# Altium project UCLA-DRS4-2.1.PrjPCB (part 2 of 7)

## Sheet ANA_FE.SchDoc: My title
size A3; Organization: University of California; Address1: 475 Portola Plaza; Address2: Los Angeles, CA 90095; Revision: R01; SheetNumber: 1; SheetTotal: 1
Used 8 times, as channels DRS-Module 0/FE0, DRS-Module 0/FE2, DRS-Module 0/FE4, DRS-Module 0/FE6, DRS-Module 0/FE1, DRS-Module 0/FE3, DRS-Module 0/FE5, DRS-Module 0/FE7. Parts and nets are listed once, with the designators drawn on the sheet.
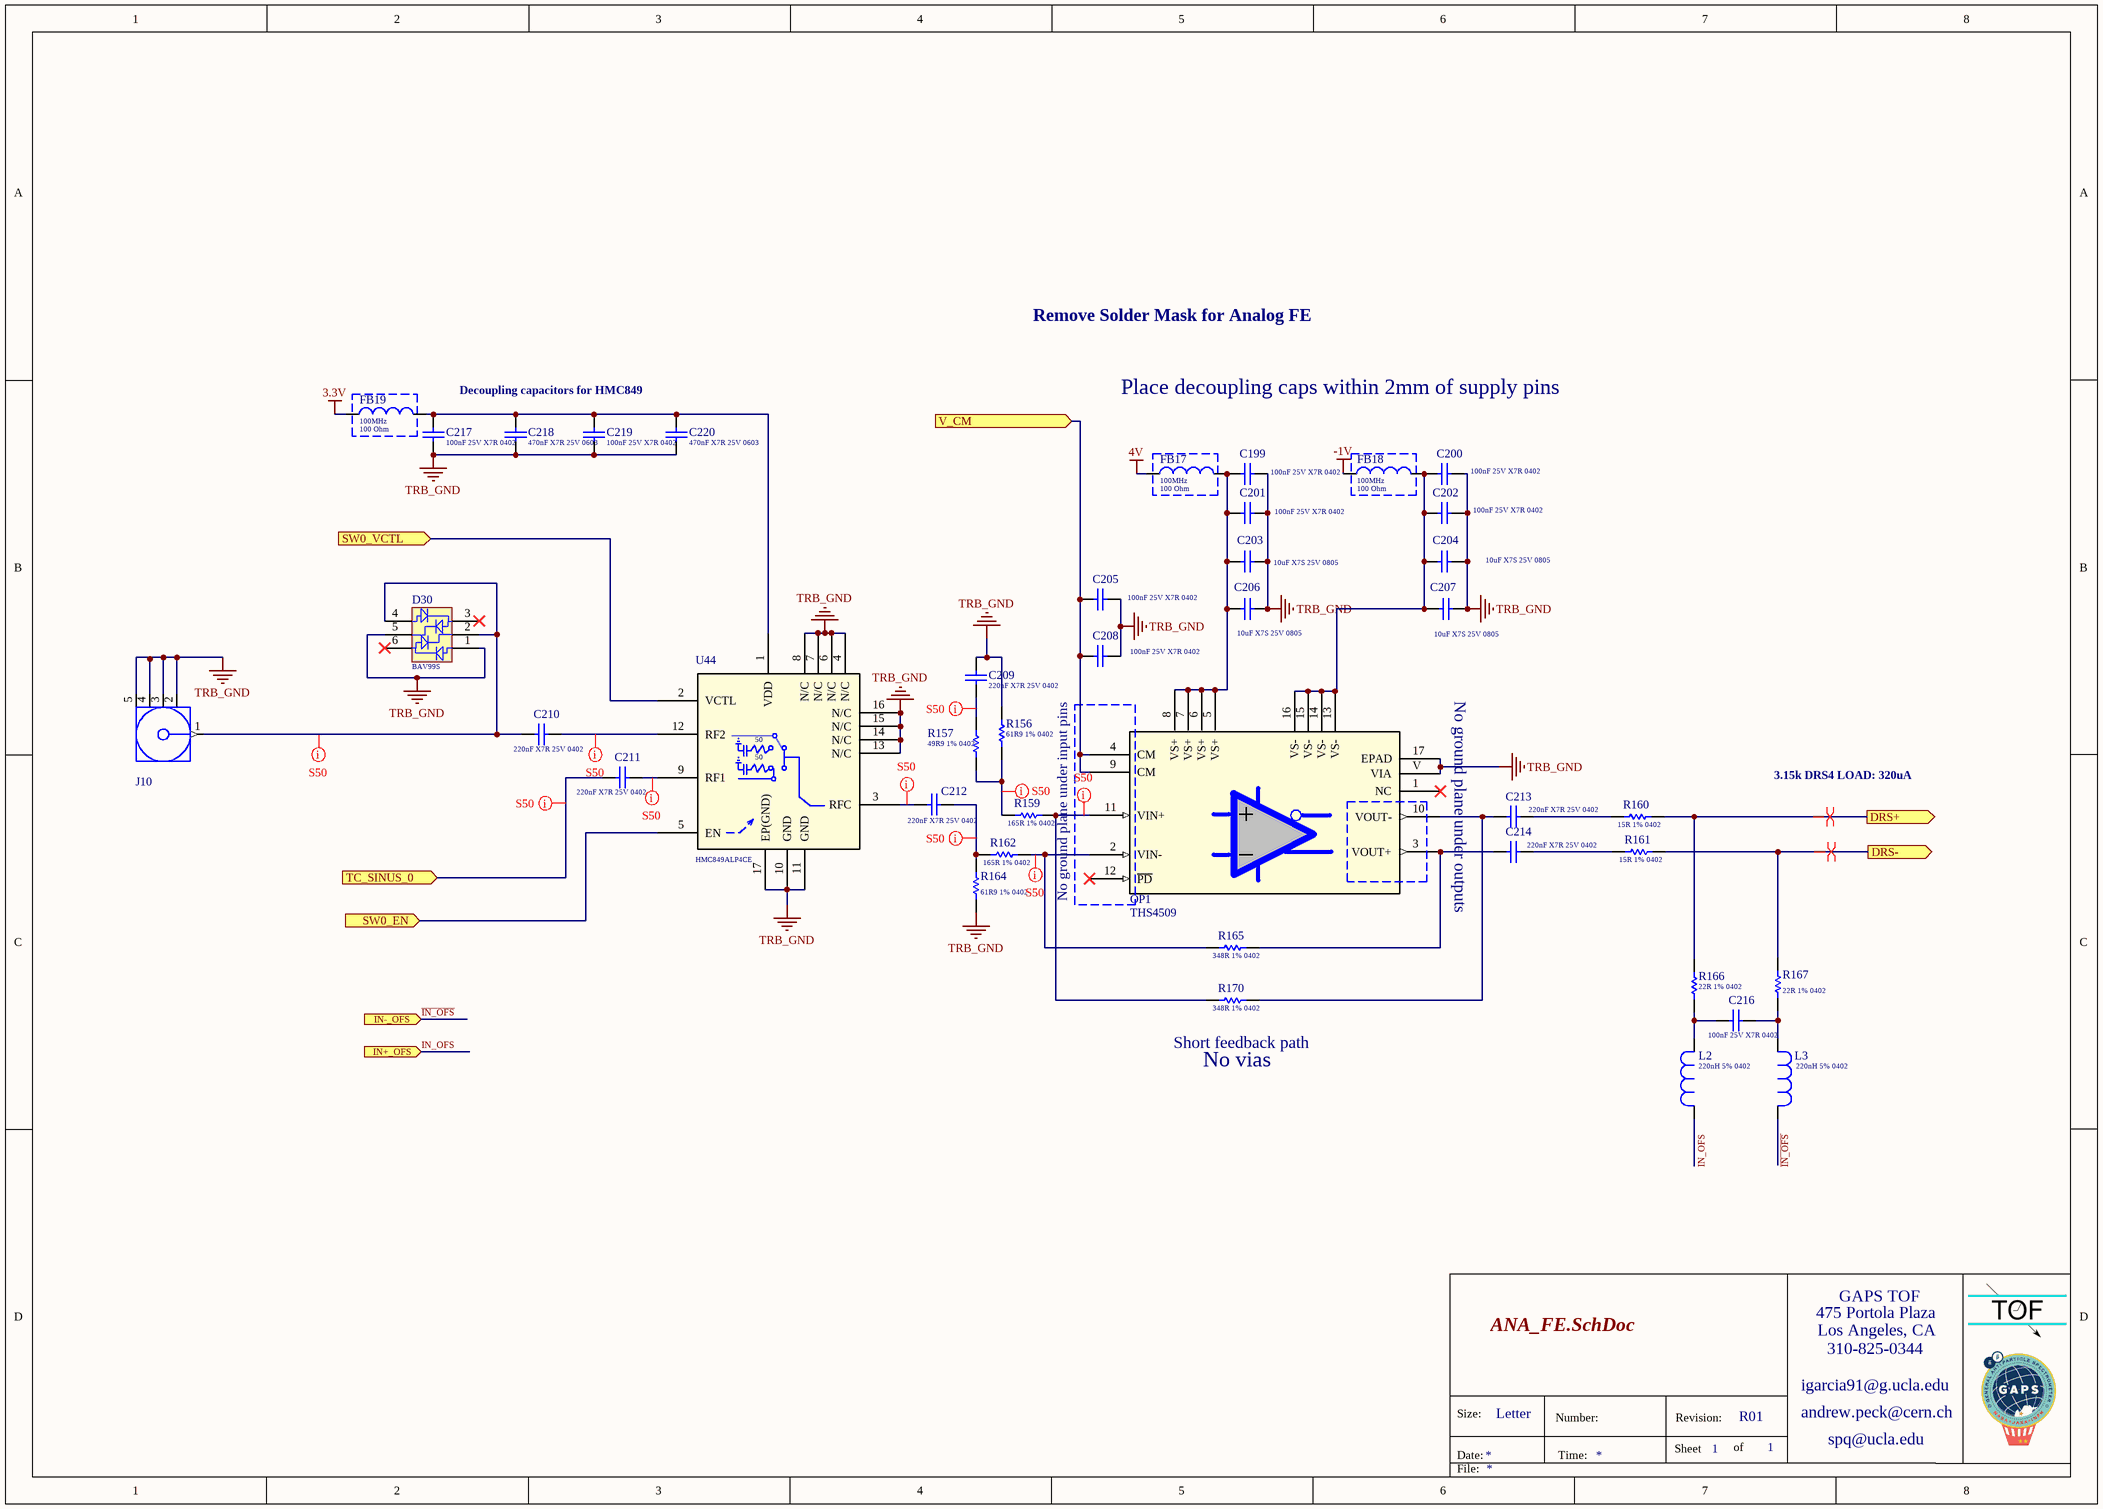
[diagram p3: ANA_FE.SchDoc]

### Parts
C199  Capacitance: 100nF 25V X7R 0402  [Cap_Taiyo_Yuden_TMK105B7104KV-FR_100nF]  (hidden comment: Cap_Taiyo_Yuden_TMK105B7104KV-FR_100nF)
C200  Capacitance: 100nF 25V X7R 0402  [Cap_Taiyo_Yuden_TMK105B7104KV-FR_100nF]  (hidden comment: Cap_Taiyo_Yuden_TMK105B7104KV-FR_100nF)
C201  Capacitance: 100nF 25V X7R 0402  [Cap_Taiyo_Yuden_TMK105B7104KV-FR_100nF]  (hidden comment: Cap_Taiyo_Yuden_TMK105B7104KV-FR_100nF)
C202  Capacitance: 100nF 25V X7R 0402  [Cap_Taiyo_Yuden_TMK105B7104KV-FR_100nF]  (hidden comment: Cap_Taiyo_Yuden_TMK105B7104KV-FR_100nF)
C203  Capacitance: 10uF X7S 25V 0805  [Cap_Murata_ GRM21BC71E106ME11L_10uF]  (hidden comment: Cap_Murata_ GRM21BC71E106ME11L_10uF)
C204  Capacitance: 10uF X7S 25V 0805  [Cap_Murata_ GRM21BC71E106ME11L_10uF]  (hidden comment: Cap_Murata_ GRM21BC71E106ME11L_10uF)
C205  Capacitance: 100nF 25V X7R 0402  [Cap_Taiyo_Yuden_TMK105B7104KV-FR_100nF]  (hidden comment: Cap_Taiyo_Yuden_TMK105B7104KV-FR_100nF)
C206  Capacitance: 10uF X7S 25V 0805  [Cap_Murata_ GRM21BC71E106ME11L_10uF]  (hidden comment: Cap_Murata_ GRM21BC71E106ME11L_10uF)
C207  Capacitance: 10uF X7S 25V 0805  [Cap_Murata_ GRM21BC71E106ME11L_10uF]  (hidden comment: Cap_Murata_ GRM21BC71E106ME11L_10uF)
C208  Capacitance: 100nF 25V X7R 0402  [Cap_Taiyo_Yuden_TMK105B7104KV-FR_100nF]  (hidden comment: Cap_Taiyo_Yuden_TMK105B7104KV-FR_100nF)
C209  Capacitance: 220nF X7R 25V 0402  [Cap_TDK_C1608X5R1A106M080AC_220nF]  (hidden comment: Cap_TDK_C1608X5R1A106M080AC_220nF)
C210  Capacitance: 220nF X7R 25V 0402  [Cap_TDK_C1608X5R1A106M080AC_220nF]  (hidden comment: Cap_TDK_C1608X5R1A106M080AC_220nF)
C211  Capacitance: 220nF X7R 25V 0402  [Cap_TDK_C1608X5R1A106M080AC_220nF]  (hidden comment: Cap_TDK_C1608X5R1A106M080AC_220nF)
C212  Capacitance: 220nF X7R 25V 0402  [Cap_TDK_C1608X5R1A106M080AC_220nF]  (hidden comment: Cap_TDK_C1608X5R1A106M080AC_220nF)
C213  Capacitance: 220nF X7R 25V 0402  [Cap_TDK_C1608X5R1A106M080AC_220nF]  (hidden comment: Cap_TDK_C1608X5R1A106M080AC_220nF)
C214  Capacitance: 220nF X7R 25V 0402  [Cap_TDK_C1608X5R1A106M080AC_220nF]  (hidden comment: Cap_TDK_C1608X5R1A106M080AC_220nF)
C216  Capacitance: 100nF 25V X7R 0402  [Cap_Taiyo_Yuden_TMK105B7104KV-FR_100nF]  (hidden comment: Cap_Taiyo_Yuden_TMK105B7104KV-FR_100nF)
C217  Capacitance: 100nF 25V X7R 0402  [Cap_Taiyo_Yuden_TMK105B7104KV-FR_100nF]  (hidden comment: Cap_Taiyo_Yuden_TMK105B7104KV-FR_100nF)
C218  Capacitance: 470nF X7R 25V 0603  [Cap_Wurth_Electronics_885012206075_470nF]  (hidden comment: Cap_Wurth_Electronics_885012206075_470nF)
C219  Capacitance: 100nF 25V X7R 0402  [Cap_Taiyo_Yuden_TMK105B7104KV-FR_100nF]  (hidden comment: Cap_Taiyo_Yuden_TMK105B7104KV-FR_100nF)
C220  Capacitance: 470nF X7R 25V 0603  [Cap_Wurth_Electronics_885012206075_470nF]  (hidden comment: Cap_Wurth_Electronics_885012206075_470nF)
D30  BAV99S  [INF-SOT363_V]
FB17  Measuring Frequency: 100MHz  Impedance: 100 Ohm  [FB_Wurth_Electronics_742792731_100Ohms]  (hidden comment: 742792731)
FB18  Measuring Frequency: 100MHz  Impedance: 100 Ohm  [FB_Wurth_Electronics_742792731_100Ohms]  (hidden comment: 742792731)
FB19  Measuring Frequency: 100MHz  Impedance: 100 Ohm  [FB_Wurth_Electronics_742792731_100Ohms]  (hidden comment: 742792731)
J10  CONREVSMA003.062  [CON-SMA-EDGE062]  (value not drawn)
L2  Inductance: 220nH 5% 0402  [Ind_TDK_ MLG1005SR22JT000_220nH]  (hidden comment: Ind_TDK_ MLG1005SR22JT000_220nH)
L3  Inductance: 220nH 5% 0402  [Ind_TDK_ MLG1005SR22JT000_220nH]  (hidden comment: Ind_TDK_ MLG1005SR22JT000_220nH)
OP1  THS4509  [RGT16]
R156  61R9 1% 0402  [RESC0402(1005)_L]
R157  49R9 1% 0402  [RESC0402(1005)_L]
R159  165R 1% 0402  [RESC0402(1005)_L]
R160  15R 1% 0402  [RESC0402(1005)_L]
R161  15R 1% 0402  [RESC0402(1005)_L]
R162  165R 1% 0402  [RESC0402(1005)_L]
R164  61R9 1% 0402  [RESC0402(1005)_L]
R165  348R 1% 0402  [RESC0402(1005)_L]
R166  22R 1% 0402  [RESC0402(1005)_L]
R167  22R 1% 0402  [RESC0402(1005)_L]
R170  348R 1% 0402  [RESC0402(1005)_L]
U44  HMC849  [CP_16_40]  (value not drawn)

### Ports
DRS+ (out), DRS- (out), IN+_OFS (in), IN-_OFS (in), SW0_EN (in), SW0_VCTL (in), TC_SINUS_0 (in), V_CM (in)

### Nets
3.3V: FB19.1
4V: FB17.1
-1V: FB18.1
TRB_GND: C199.2 C200.2 C201.2 C202.2 C203.1 C204.1 C205.2 C206.1 C207.1 C208.2 C209.1 C217.1 C218.2 C219.1 C220.2 D30.1(A1) D30.5(K5) J10.2(GND) J10.3(GND) J10.4(GND) J10.5(GND) OP1.17(EPAD) OP1.V(VIA) R156.2 R164.1 U44.4(N/C) U44.6(N/C) U44.7(N/C) U44.8(N/C) U44.10(GND) U44.11(GND) U44.13(N/C) U44.14(N/C) U44.15(N/C) U44.16(N/C) U44.17(EP(GND))
DRS+: R160.2 R166.2 ; port DRS+
DRS-: R161.2 R167.2 ; port DRS-
~{IN}~{_OFS}: L3.1 ; port IN-_OFS
IN_OFS: L2.2 ; port IN+_OFS
SW0_EN: U44.5(EN) ; port SW0_EN
SW0_VCTL: U44.2(VCTL) ; port SW0_VCTL
TC_SINUS_0: C211.2 ; port TC_SINUS_0
V_CM: C205.1 C208.1 OP1.4(CM) OP1.9(CM) ; port V_CM
NetC199_1: C199.1 C201.1 C203.2 C206.2 FB17.2 OP1.5(VS+) OP1.6(VS+) OP1.7(VS+) OP1.8(VS+)
NetC200_1: C200.1 C202.1 C204.2 C207.2 FB18.2 OP1.13(VS-) OP1.14(VS-) OP1.15(VS-) OP1.16(VS-)
NetC209_2: C209.2 R157.2
NetC210_1: C210.1 U44.12(RF2)
NetC210_2: C210.2 D30.2(K2) D30.4(A4) J10.1(Signal)
NetC211_1: C211.1 U44.9(RF1)
NetC212_1: C212.1 R162.1 R164.2
NetC212_2: C212.2 U44.3(RFC)
NetC213_1: C213.1 R160.1
NetC213_2: C213.2 OP1.10(VOUT-) R170.2
NetC214_1: C214.1 R161.1
NetC214_2: C214.2 OP1.3(VOUT+) R165.2
NetC216_1: C216.1 L2.1 R166.1
NetC216_2: C216.2 L3.2 R167.1
NetC217_2: C217.2 C218.1 C219.2 C220.1 FB19.2 U44.1(VDD)
NetOP1_2: OP1.2(VIN-) R162.2 R165.1
NetOP1_11: OP1.11(VIN+) R159.2 R170.1
NetR156_1: R156.1 R157.1 R159.1

Not connected (* = marked no-connect by the designer): D30 3(C3)* 6(C6)*; OP1 1(NC)* 12(~{PD})*

### Channels
DRS-Module 0/FE0: designators end in A; ports DRS+=DRS4_IN0_P DRS-=DRS4_IN0_N IN+_OFS=IN+_OFS IN-_OFS=~{IN}~{_OFS} SW0_EN=HMC849:EN0 SW0_VCTL=HMC849:VCTL0 TC_SINUS_0=TC_0 V_CM=V_CM
DRS-Module 0/FE2: designators end in B; ports DRS+=DRS4_IN2_P DRS-=DRS4_IN2_N IN+_OFS=IN+_OFS IN-_OFS=~{IN}~{_OFS} SW0_EN=HMC849:EN2 SW0_VCTL=HMC849:VCTL2 TC_SINUS_0=TC_2 V_CM=V_CM
DRS-Module 0/FE4: designators end in C; ports DRS+=DRS4_IN4_P DRS-=DRS4_IN4_N IN+_OFS=IN+_OFS IN-_OFS=~{IN}~{_OFS} SW0_EN=HMC849:EN4 SW0_VCTL=HMC849:VCTL4 TC_SINUS_0=TC_4 V_CM=V_CM
DRS-Module 0/FE6: designators end in D; ports DRS+=DRS4_IN6_P DRS-=DRS4_IN6_N IN+_OFS=IN+_OFS IN-_OFS=~{IN}~{_OFS} SW0_EN=HMC849:EN6 SW0_VCTL=HMC849:VCTL6 TC_SINUS_0=TC_6 V_CM=V_CM
DRS-Module 0/FE1: designators end in E; ports DRS+=DRS4_IN1_P DRS-=DRS4_IN1_N IN+_OFS=IN+_OFS IN-_OFS=~{IN}~{_OFS} SW0_EN=HMC849:EN1 SW0_VCTL=HMC849:VCTL1 TC_SINUS_0=TC_1 V_CM=V_CM
DRS-Module 0/FE3: designators end in F; ports DRS+=DRS4_IN3_P DRS-=DRS4_IN3_N IN+_OFS=IN+_OFS IN-_OFS=~{IN}~{_OFS} SW0_EN=HMC849:EN3 SW0_VCTL=HMC849:VCTL3 TC_SINUS_0=TC_3 V_CM=V_CM
DRS-Module 0/FE5: designators end in G; ports DRS+=DRS4_IN5_P DRS-=DRS4_IN5_N IN+_OFS=IN+_OFS IN-_OFS=~{IN}~{_OFS} SW0_EN=HMC849:EN5 SW0_VCTL=HMC849:VCTL5 TC_SINUS_0=TC_5 V_CM=V_CM
DRS-Module 0/FE7: designators end in H; ports DRS+=DRS4_IN7_P DRS-=DRS4_IN7_N IN+_OFS=IN+_OFS IN-_OFS=~{IN}~{_OFS} SW0_EN=HMC849:EN7 SW0_VCTL=HMC849:VCTL7 TC_SINUS_0=TC_7 V_CM=V_CM

### Layout directives
net class S50: NetC209A_2, NetC210A_1, NetC210A_2, NetC211A_1, NetC212A_1, NetC212A_2, NetOP1A_2, NetOP1A_11, NetR156A_1, TC_0
differential pair: DRS4_IN0_N, DRS4_IN0_P

### Notes on the sheet
- Remove Solder Mask for Analog FE
- Decoupling capacitors for HMC849
- Place decoupling caps within 2mm of supply pins
- No ground plane under outputs
- 3.15k DRS4 LOAD: 320uA
- (near R159) No ground plane under input pins
- (near R170) Short feedback path
- (near R170) No vias
- 475 Portola Plaza
- GAPS TOF
- igarcia91@g.ucla.edu
- Los Angeles, CA
- 310-825-0344
- Size:
- Date:
- Letter
- Number:
- Time:
- Sheet
- Revision:
- of
- andrew.peck@cern.ch
- spq@ucla.edu
- File:
- (in symbol HMC849ALP4CE) 50

### Library data of the parts
C199-C202 C205 C208 C216 C217 C219 = Cap_Taiyo_Yuden_TMK105B7104KV-FR_100nF: CAP CER 100nF 25V X7R 0402; Supplier 1: Mouser; Supplier Part Number 1: 963-TMK105B7104KV-FR
C203 C204 C206 C207 = Cap_Murata_ GRM21BC71E106ME11L_10uF: CAP CER 10uF 25V X7R 0805; Supplier 1: Mouser; Supplier Part Number 1: 81-GRM21BC71E106ME1L
C209-C214 = Cap_TDK_C1608X5R1A106M080AC_220nF: CAP CER 220nF 50V X7R 0402; Supplier 1: Mouser; Supplier Part Number 1: 810-C1005X7R1E224KBE
C218 C220 = Cap_Wurth_Electronics_885012206075_470nF: CAP CER 470nF 25V X7R 0603; Supplier 1: Mouser; Supplier Part Number 1: 710-885012206075
D30 = CMP-1176-00030-1: Silicon Switching Diode, SOT363, Reel, Green; Manufacturer: Infineon; VR (max): 80Â V; VBR (min): 85Â V; IF (max): 200Â mA; trr (max): 4Â ns; Green: TRUE; VF (max): 1.25Â V; Configuration: Quadruple; IR (max): 150Â nA; PackageReference: SOT363; Halogen-free: TRUE; ComponentLink3URL: http://www.infineon.com/dgdl/SOT363-Package_Overview.pdf?folderId=db3a30431936bc4b01195360bd8f3cdc&fileId=db3a30431936bc4b0119536b62bf3cf5; PartNumber: BAV99S; ComponentLink3Description: Package Specification; ComponentLink2URL: http://www.infineon.com/dgdl/bav99series.pdf?folderId=db3a30431400ef6801141b5844e103ea&fileId=db3a30431400ef6801141c1b237d042f; ComponentLink1Description: Manufacturer URL; ComponentLink2Description: Datasheet; ComponentLink1URL: http://www.infineon.com/; PackageDescription: 6-Pin Small Outline Transistor Package, 1.25 x 2 mm Body; Mounting Technology: Surface Mount
FB17-FB19 = FB_Wurth_Electronics_742792731_100Ohms: FB SMD 100 OHM 25% 1.2A 0402; DC Resistance: 90mOhm; Supplier 1: Mouser; Supplier Part Number 1: 710-742792731
J10 = CMP-0168-00046-1: PCB_Layout: Pads complies with manufacturer's recommendation.; DatasheetVersion: rev1.0, Jun-2006; PackageVersion: rev1.0, Jun-2006; PackageReference: CON-SMA-EDGE062
L2 L3 = Ind_TDK_ MLG1005SR22JT000_220nH: Fixed Inductors .22 UH 5%; Supplier 1: Mouser; Supplier Part Number 1: 810-MLG1005SR22JT000
OP1 = THS4509RGTT: Imported; Vendor: Texas Instruments; Built_By: EMA_UL_Team; C: Copyright (C) 2015 Accelerated Designs. All rights reserved; Manufacturer_Part_Number: THS4509RGTT; RefDes: RefDes; Type: DEV; Value: Value; Supplier 1: Mouser; Supplier Part Number 1: 595-THS4509RGTT
R156 R164 = CMP-1011-00374-1: 61R9 0.063W 1% 0402 (1005 Metric)  SMD; Value: 61.90 Ohm; Case-EIA: 0402; Case-Metric: 1005; Tolerance: 1 %; Technology: SMT; Power: 0.063 W
R157 = CMP-1011-00363-1: 49R9 0.063W 1% 0402 (1005 Metric)  SMD; Case-EIA: 0402; Case-Metric: 1005; Value: 49.90 Ohm; Power: 0.063 W; Technology: SMT; Tolerance: 1 %
R159 R162 = CMP-1011-00420-1: 165R 0.063W 1% 0402 (1005 Metric)  SMD; Case-EIA: 0402; Case-Metric: 1005; Value: 165.00 Ohm; Power: 0.063 W; Technology: SMT; Tolerance: 1 %
R160 R161 = CMP-1011-00302-1: 15R 0.063W 1% 0402 (1005 Metric)  SMD; Case-Metric: 1005; Case-EIA: 0402; Value: 15.00 Ohm; Tolerance: 1 %; Power: 0.063 W; Technology: SMT
R165 R170 = CMP-1011-00457-1: 348R 0.063W 1% 0402 (1005 Metric)  SMD; Case-EIA: 0402; Value: 348.00 Ohm; Case-Metric: 1005; Tolerance: 1 %; Technology: SMT; Power: 0.063 W
R166 R167 = CMP-1011-00320-1: 22R 0.063W 1% 0402 (1005 Metric)  SMD; Case-EIA: 0402; Case-Metric: 1005; Value: 22.00 Ohm; Tolerance: 1 %; Technology: SMT; Power: 0.063 W
U44 = HMC849ALP4CE: RF Switch ICs DC-6 GHZ Hi Isolation Switch; Vendor: Analog Devices Inc; Built_By: Analog Devices Imc.; Manufacturer_Part_Number: HMC849ALP4CE; RefDes: RefDes; Type: DEV; Supplier 1: Mouser; Supplier Part Number 1: 584-HMC849ALP4CE; Series: HMC849ALP4CE

## Sheet DRS4_ADC.SchDoc: My title
size A3; Organization: University of California; Address1: 475 Portola Plaza; Address2: Los Angeles, CA 90095; Revision: R01; SheetNumber: 1; SheetTotal: 1
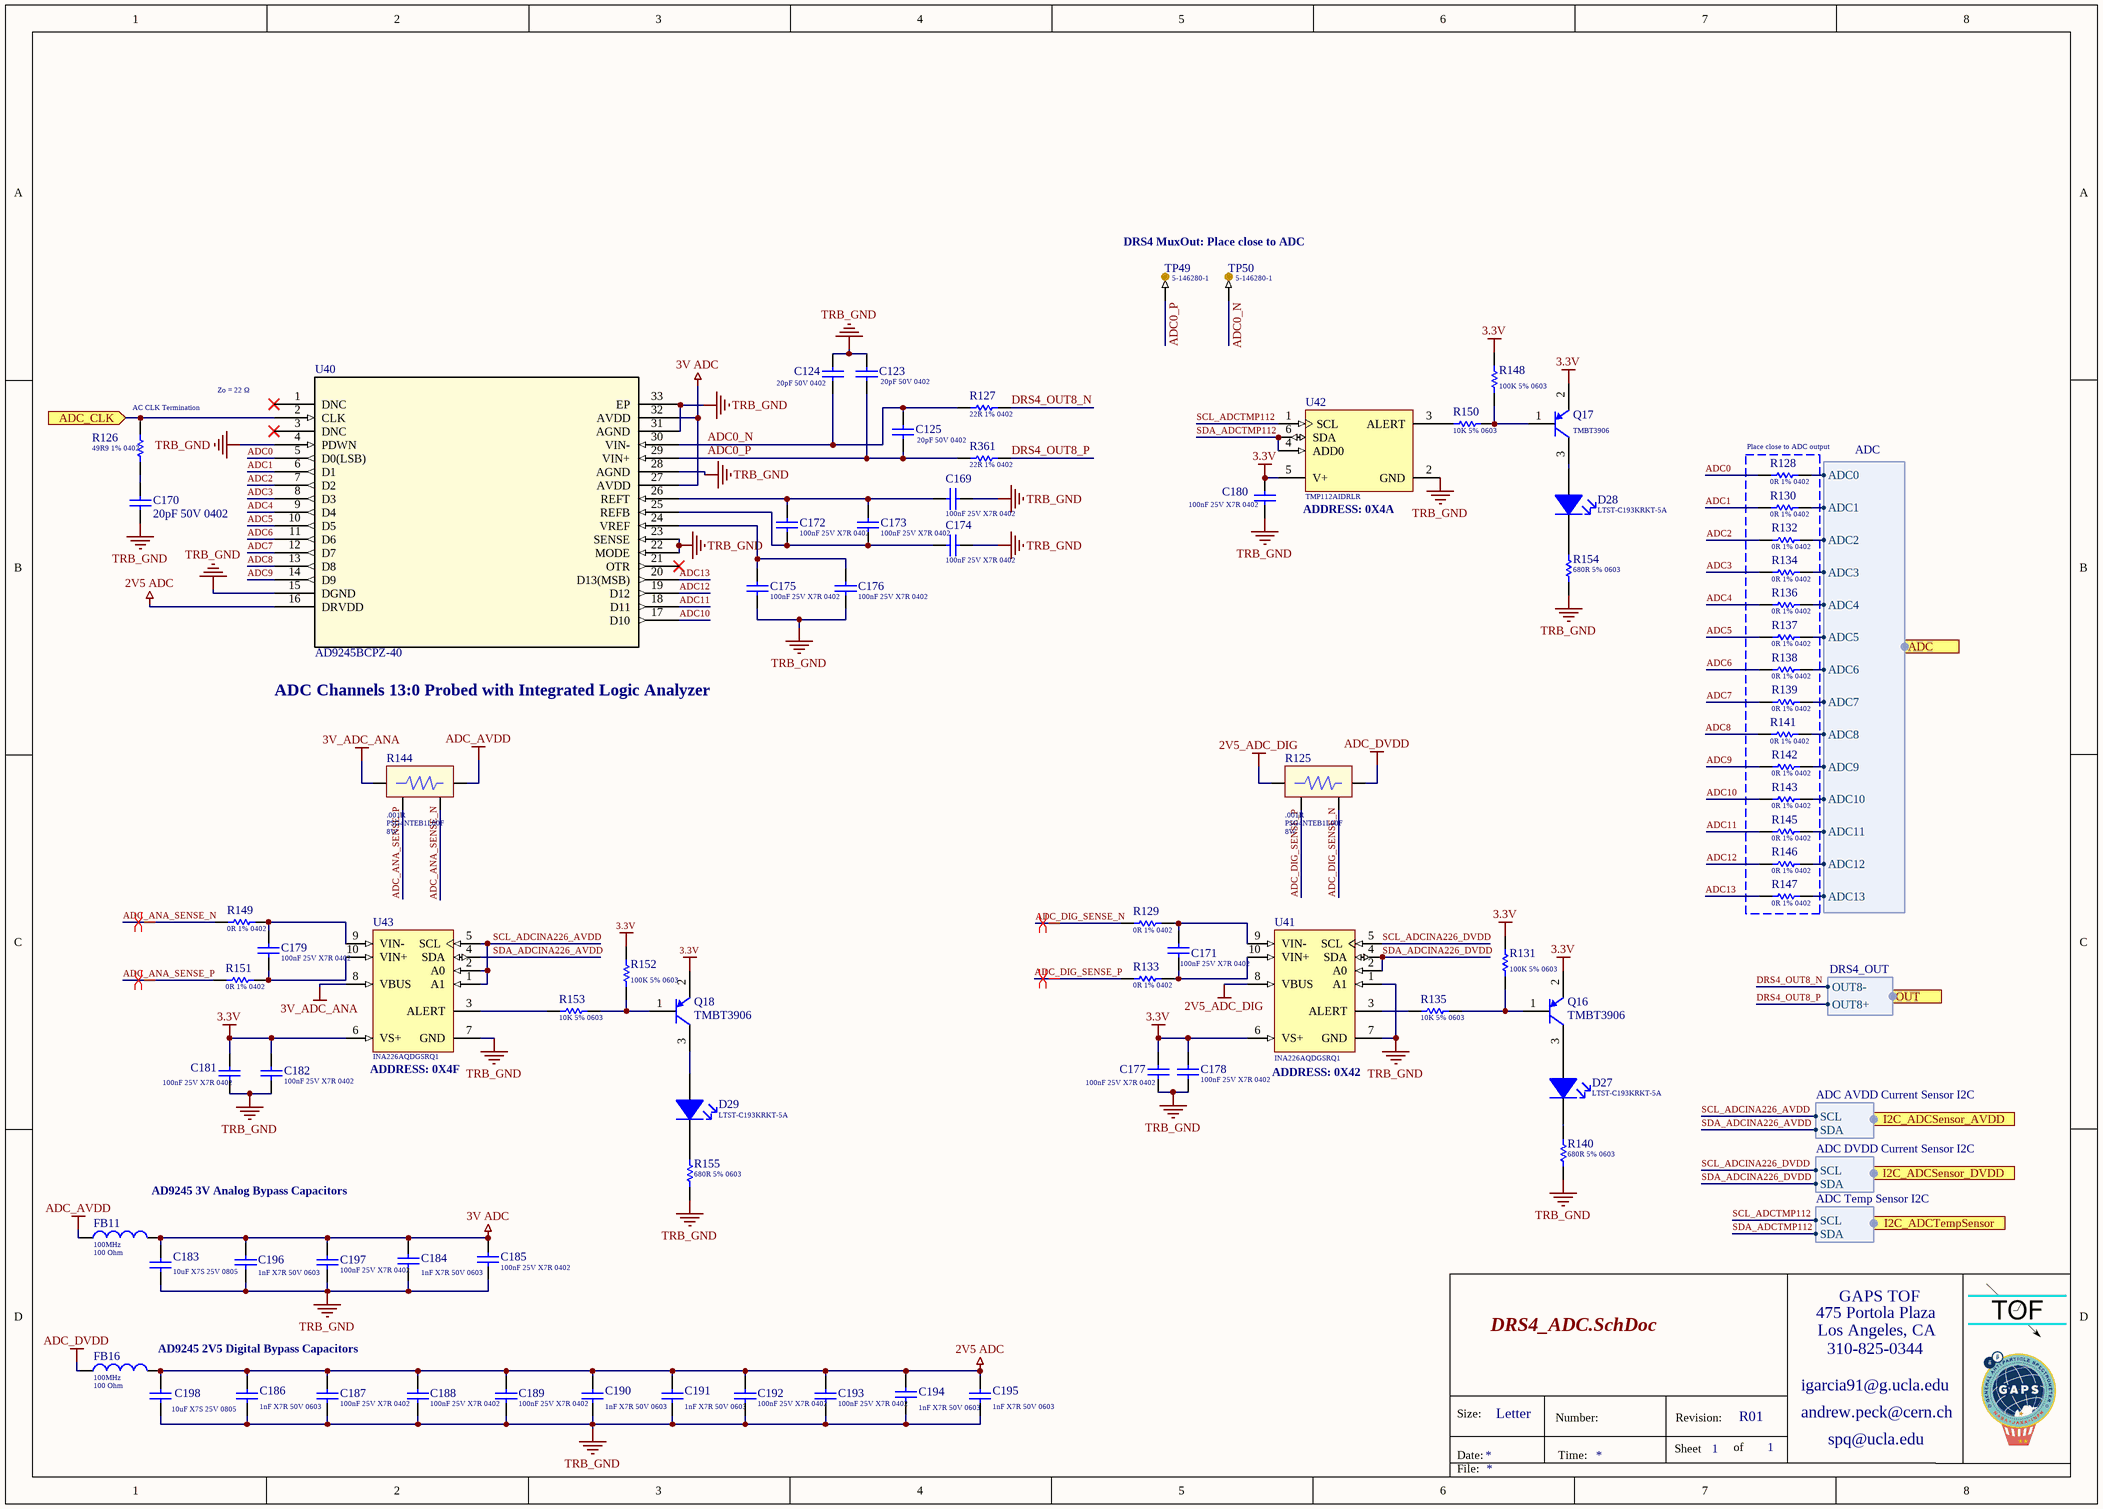
[diagram p4: DRS4_ADC.SchDoc]

### Parts
C123  Capacitance: 20pF 50V 0402  [Cap_Murata_GJM1555C1H200GB01D_20pF]  (hidden comment: Cap_Murata_GJM1555C1H200GB01D_20pF)
C124  Capacitance: 20pF 50V 0402  [Cap_Murata_GJM1555C1H200GB01D_20pF]  (hidden comment: Cap_Murata_GJM1555C1H200GB01D_20pF)
C125  Capacitance: 20pF 50V 0402  [Cap_Murata_GJM1555C1H200GB01D_20pF]  (hidden comment: Cap_Murata_GJM1555C1H200GB01D_20pF)
C169  Capacitance: 100nF 25V X7R 0402  [Cap_Taiyo_Yuden_TMK105B7104KV-FR_100nF]  (hidden comment: Cap_Taiyo_Yuden_TMK105B7104KV-FR_100nF)
C170  Capacitance: 20pF 50V 0402  [Cap_Murata_GJM1555C1H200GB01D_20pF]  (hidden comment: Cap_Murata_GJM1555C1H200GB01D_20pF)
C171  Capacitance: 100nF 25V X7R 0402  [Cap_Taiyo_Yuden_TMK105B7104KV-FR_100nF]  (hidden comment: Cap_Taiyo_Yuden_TMK105B7104KV-FR_100nF)
C172  Capacitance: 100nF 25V X7R 0402  [Cap_Taiyo_Yuden_TMK105B7104KV-FR_100nF]  (hidden comment: Cap_Taiyo_Yuden_TMK105B7104KV-FR_100nF)
C173  Capacitance: 100nF 25V X7R 0402  [Cap_Taiyo_Yuden_TMK105B7104KV-FR_100nF]  (hidden comment: Cap_Taiyo_Yuden_TMK105B7104KV-FR_100nF)
C174  Capacitance: 100nF 25V X7R 0402  [Cap_Taiyo_Yuden_TMK105B7104KV-FR_100nF]  (hidden comment: Cap_Taiyo_Yuden_TMK105B7104KV-FR_100nF)
C175  Capacitance: 100nF 25V X7R 0402  [Cap_Taiyo_Yuden_TMK105B7104KV-FR_100nF]  (hidden comment: Cap_Taiyo_Yuden_TMK105B7104KV-FR_100nF)
C176  Capacitance: 100nF 25V X7R 0402  [Cap_Taiyo_Yuden_TMK105B7104KV-FR_100nF]  (hidden comment: Cap_Taiyo_Yuden_TMK105B7104KV-FR_100nF)
C177  Capacitance: 100nF 25V X7R 0402  [Cap_Taiyo_Yuden_TMK105B7104KV-FR_100nF]  (hidden comment: Cap_Taiyo_Yuden_TMK105B7104KV-FR_100nF)
C178  Capacitance: 100nF 25V X7R 0402  [Cap_Taiyo_Yuden_TMK105B7104KV-FR_100nF]  (hidden comment: Cap_Taiyo_Yuden_TMK105B7104KV-FR_100nF)
C179  Capacitance: 100nF 25V X7R 0402  [Cap_Taiyo_Yuden_TMK105B7104KV-FR_100nF]  (hidden comment: Cap_Taiyo_Yuden_TMK105B7104KV-FR_100nF)
C180  Capacitance: 100nF 25V X7R 0402  [Cap_Taiyo_Yuden_TMK105B7104KV-FR_100nF]  (hidden comment: Cap_Taiyo_Yuden_TMK105B7104KV-FR_100nF)
C181  Capacitance: 100nF 25V X7R 0402  [Cap_Taiyo_Yuden_TMK105B7104KV-FR_100nF]  (hidden comment: Cap_Taiyo_Yuden_TMK105B7104KV-FR_100nF)
C182  Capacitance: 100nF 25V X7R 0402  [Cap_Taiyo_Yuden_TMK105B7104KV-FR_100nF]  (hidden comment: Cap_Taiyo_Yuden_TMK105B7104KV-FR_100nF)
C183  Capacitance: 10uF X7S 25V 0805  [Cap_Murata_ GRM21BC71E106ME11L_10uF]  (hidden comment: Cap_Murata_ GRM21BC71E106ME11L_10uF)
C184  Capacitance: 1nF X7R 50V 0603  [Cap_Kemet_C0603C102J5RACAUTO_1nF]  (hidden comment: Cap_Kemet_C0603C102J5RACAUTO_1nF)
C185  Capacitance: 100nF 25V X7R 0402  [Cap_Taiyo_Yuden_TMK105B7104KV-FR_100nF]  (hidden comment: Cap_Taiyo_Yuden_TMK105B7104KV-FR_100nF)
C186  Capacitance: 1nF X7R 50V 0603  [Cap_Kemet_C0603C102J5RACAUTO_1nF]  (hidden comment: Cap_Kemet_C0603C102J5RACAUTO_1nF)
C187  Capacitance: 100nF 25V X7R 0402  [Cap_Taiyo_Yuden_TMK105B7104KV-FR_100nF]  (hidden comment: Cap_Taiyo_Yuden_TMK105B7104KV-FR_100nF)
C188  Capacitance: 100nF 25V X7R 0402  [Cap_Taiyo_Yuden_TMK105B7104KV-FR_100nF]  (hidden comment: Cap_Taiyo_Yuden_TMK105B7104KV-FR_100nF)
C189  Capacitance: 100nF 25V X7R 0402  [Cap_Taiyo_Yuden_TMK105B7104KV-FR_100nF]  (hidden comment: Cap_Taiyo_Yuden_TMK105B7104KV-FR_100nF)
C190  Capacitance: 1nF X7R 50V 0603  [Cap_Kemet_C0603C102J5RACAUTO_1nF]  (hidden comment: Cap_Kemet_C0603C102J5RACAUTO_1nF)
C191  Capacitance: 1nF X7R 50V 0603  [Cap_Kemet_C0603C102J5RACAUTO_1nF]  (hidden comment: Cap_Kemet_C0603C102J5RACAUTO_1nF)
C192  Capacitance: 100nF 25V X7R 0402  [Cap_Taiyo_Yuden_TMK105B7104KV-FR_100nF]  (hidden comment: Cap_Taiyo_Yuden_TMK105B7104KV-FR_100nF)
C193  Capacitance: 100nF 25V X7R 0402  [Cap_Taiyo_Yuden_TMK105B7104KV-FR_100nF]  (hidden comment: Cap_Taiyo_Yuden_TMK105B7104KV-FR_100nF)
C194  Capacitance: 1nF X7R 50V 0603  [Cap_Kemet_C0603C102J5RACAUTO_1nF]  (hidden comment: Cap_Kemet_C0603C102J5RACAUTO_1nF)
C195  Capacitance: 1nF X7R 50V 0603  [Cap_Kemet_C0603C102J5RACAUTO_1nF]  (hidden comment: Cap_Kemet_C0603C102J5RACAUTO_1nF)
C196  Capacitance: 1nF X7R 50V 0603  [Cap_Kemet_C0603C102J5RACAUTO_1nF]  (hidden comment: Cap_Kemet_C0603C102J5RACAUTO_1nF)
C197  Capacitance: 100nF 25V X7R 0402  [Cap_Taiyo_Yuden_TMK105B7104KV-FR_100nF]  (hidden comment: Cap_Taiyo_Yuden_TMK105B7104KV-FR_100nF)
C198  Capacitance: 10uF X7S 25V 0805  [Cap_Murata_ GRM21BC71E106ME11L_10uF]  (hidden comment: Cap_Murata_ GRM21BC71E106ME11L_10uF)
D27  LTST-C193KRKT-5A  [Led_Lite-On_LTST-C193KGKT-5A_Red]
D28  LTST-C193KRKT-5A  [Led_Lite-On_LTST-C193KGKT-5A_Red]
D29  LTST-C193KRKT-5A  [Led_Lite-On_LTST-C193KGKT-5A_Red]
FB11  Measuring Frequency: 100MHz  Impedance: 100 Ohm  [FB_Wurth_Electronics_742792731_100Ohms]  (hidden comment: 742792731)
FB16  Measuring Frequency: 100MHz  Impedance: 100 Ohm  [FB_Wurth_Electronics_742792731_100Ohms]  (hidden comment: 742792731)
Q16  Series: TMBT3906  [BJT_PNP_Toshiba_TMBT3906]  (hidden comment: BJT_PNP_Toshiba_TMBT3906)
Q17  Series: TMBT3906  [BJT_PNP_Toshiba_TMBT3906]  (hidden comment: BJT_PNP_Toshiba_TMBT3906)
Q18  Series: TMBT3906  [BJT_PNP_Toshiba_TMBT3906]  (hidden comment: BJT_PNP_Toshiba_TMBT3906)
R125  Resistance: .001R  Series: PSG4NTEB1L00F  Parameter 1: 8W  [SRes_KOA_PSG4NTEB1L00F_1mOhm]  (hidden comment: SRes_KOA_PSG4NTEB1L00F_1mOhm)
R126  49R9 1% 0402  [RESC0402(1005)_L]
R127  22R 1% 0402  [RESC0402(1005)_L]
R128  Resistance: 0R 1% 0402  [Res_Vishay_CRCW04020000Z0EDC_0_Ohm]  (hidden comment: Res_Vishay_CRCW04020000Z0EDC_0_Ohm)
R129  Resistance: 0R 1% 0402  [Res_Vishay_CRCW04020000Z0EDC_0_Ohm]  (hidden comment: Res_Vishay_CRCW04020000Z0EDC_0_Ohm)
R130  Resistance: 0R 1% 0402  [Res_Vishay_CRCW04020000Z0EDC_0_Ohm]  (hidden comment: Res_Vishay_CRCW04020000Z0EDC_0_Ohm)
R131  100K 5% 0603  [RESC0603(1608)_N]
R132  Resistance: 0R 1% 0402  [Res_Vishay_CRCW04020000Z0EDC_0_Ohm]  (hidden comment: Res_Vishay_CRCW04020000Z0EDC_0_Ohm)
R133  Resistance: 0R 1% 0402  [Res_Vishay_CRCW04020000Z0EDC_0_Ohm]  (hidden comment: Res_Vishay_CRCW04020000Z0EDC_0_Ohm)
R134  Resistance: 0R 1% 0402  [Res_Vishay_CRCW04020000Z0EDC_0_Ohm]  (hidden comment: Res_Vishay_CRCW04020000Z0EDC_0_Ohm)
R135  10K 5% 0603  [RESC0603(1608)_L]
R136  Resistance: 0R 1% 0402  [Res_Vishay_CRCW04020000Z0EDC_0_Ohm]  (hidden comment: Res_Vishay_CRCW04020000Z0EDC_0_Ohm)
R137  Resistance: 0R 1% 0402  [Res_Vishay_CRCW04020000Z0EDC_0_Ohm]  (hidden comment: Res_Vishay_CRCW04020000Z0EDC_0_Ohm)
R138  Resistance: 0R 1% 0402  [Res_Vishay_CRCW04020000Z0EDC_0_Ohm]  (hidden comment: Res_Vishay_CRCW04020000Z0EDC_0_Ohm)
R139  Resistance: 0R 1% 0402  [Res_Vishay_CRCW04020000Z0EDC_0_Ohm]  (hidden comment: Res_Vishay_CRCW04020000Z0EDC_0_Ohm)
R140  680R 5% 0603  [RESC0603(1608)_L]
R141  Resistance: 0R 1% 0402  [Res_Vishay_CRCW04020000Z0EDC_0_Ohm]  (hidden comment: Res_Vishay_CRCW04020000Z0EDC_0_Ohm)
R142  Resistance: 0R 1% 0402  [Res_Vishay_CRCW04020000Z0EDC_0_Ohm]  (hidden comment: Res_Vishay_CRCW04020000Z0EDC_0_Ohm)
R143  Resistance: 0R 1% 0402  [Res_Vishay_CRCW04020000Z0EDC_0_Ohm]  (hidden comment: Res_Vishay_CRCW04020000Z0EDC_0_Ohm)
R144  Resistance: .001R  Series: PSG4NTEB1L00F  Parameter 1: 8W  [SRes_KOA_PSG4NTEB1L00F_1mOhm]  (hidden comment: SRes_KOA_PSG4NTEB1L00F_1mOhm)
R145  Resistance: 0R 1% 0402  [Res_Vishay_CRCW04020000Z0EDC_0_Ohm]  (hidden comment: Res_Vishay_CRCW04020000Z0EDC_0_Ohm)
R146  Resistance: 0R 1% 0402  [Res_Vishay_CRCW04020000Z0EDC_0_Ohm]  (hidden comment: Res_Vishay_CRCW04020000Z0EDC_0_Ohm)
R147  Resistance: 0R 1% 0402  [Res_Vishay_CRCW04020000Z0EDC_0_Ohm]  (hidden comment: Res_Vishay_CRCW04020000Z0EDC_0_Ohm)
R148  100K 5% 0603  [RESC0603(1608)_N]
R149  Resistance: 0R 1% 0402  [Res_Vishay_CRCW04020000Z0EDC_0_Ohm]  (hidden comment: Res_Vishay_CRCW04020000Z0EDC_0_Ohm)
R150  10K 5% 0603  [RESC0603(1608)_L]
R151  Resistance: 0R 1% 0402  [Res_Vishay_CRCW04020000Z0EDC_0_Ohm]  (hidden comment: Res_Vishay_CRCW04020000Z0EDC_0_Ohm)
R152  100K 5% 0603  [RESC0603(1608)_N]
R153  10K 5% 0603  [RESC0603(1608)_L]
R154  680R 5% 0603  [RESC0603(1608)_L]
R155  680R 5% 0603  [RESC0603(1608)_L]
R361  22R 1% 0402  [RESC0402(1005)_L]
TP49  Series: 5-146280-1  [TP_TE_Connectivity_5-146280-1_1POS]  (hidden comment: TP_TE_Connectivity_5-146280-1_1POS)
TP50  Series: 5-146280-1  [TP_TE_Connectivity_5-146280-1_1POS]  (hidden comment: TP_TE_Connectivity_5-146280-1_1POS)
U40  AD9245  [CP_32_2]  (value not drawn)
U41  INA226AQDGSRQ1  [INA226AQDGSRQ1]
U42  TMP112AIDRLR  [TMP112AIDRLR]
U43  INA226AQDGSRQ1  [INA226AQDGSRQ1]

### Blocks framed on the sheet
Place close to ADC output: R128 R130 R132 R134 R136-R139 R141-R143 R145-R147

### Ports
ADC (harness ADC), ADC_CLK (in), I2C_ADCSensor_AVDD (harness ADC AVDD Current Sensor I2C), I2C_ADCSensor_DVDD (harness ADC DVDD Current Sensor I2C), I2C_ADCTempSensor (harness ADC Temp Sensor I2C), OUT (harness DRS4_OUT)

### Harnesses
ADC: ADC0, ADC1, ADC2, ADC3, ADC4, ADC5, ADC6, ADC7, ADC8, ADC9, ADC10, ADC11, ADC12, ADC13
DRS4_OUT: OUT8+, OUT8-
ADC AVDD Current Sensor I2C: SCL, SDA
ADC Temp Sensor I2C: SCL, SDA
ADC DVDD Current Sensor I2C: SCL, SDA

### Nets
2V5 ADC: C186.2 C187.1 C188.1 C189.1 C190.2 C191.2 C192.1 C193.1 C194.2 C195.2 C198.1 FB16.2 U40.16(DRVDD)
2V5_ADC_DIG: R125.1 U41.8(VBUS)
3.3V: C177.2 C178.2 C180.1 C181.2 C182.2 Q16.2(E) Q17.2(E) Q18.2(E) R131.2 R148.2 R152.2 U41.6(VS+) U42.5(V+) U43.6(VS+)
3V ADC: C183.1 C184.2 C185.1 C196.2 C197.1 FB11.2 U40.27(AVDD) U40.32(AVDD)
3V_ADC_ANA: R144.1 U43.8(VBUS)
ADC_AVDD: FB11.1 R144.2
ADC_DVDD: FB16.1 R125.2
TRB_GND: C123.2 C124.2 C169.1 C170.1 C174.1 C175.2 C176.2 C177.1 C178.1 C180.2 C181.1 C182.1 C183.2 C184.1 C185.2 C186.1 C187.2 C188.2 C189.2 C190.1 C191.1 C192.2 C193.2 C194.1 C195.1 C196.1 C197.2 C198.2 R140.1 R154.1 R155.1 U40.4(PDWN) U40.15(DGND) U40.22(MODE) U40.23(SENSE) U40.28(AGND) U40.31(AGND) U40.33(EP) U41.1(A1) U41.7(GND) U42.2(GND) U43.7(GND)
ADC0: R128.1 U40.5(D0(LSB))
ADC0_N: C124.1 C125.2 R127.2 TP50.1 U40.30(VIN-)
ADC0_P: C123.1 C125.1 R361.2 TP49.1 U40.29(VIN+)
ADC1: R130.1 U40.6(D1)
ADC2: R132.1 U40.7(D2)
ADC3: R134.1 U40.8(D3)
ADC4: R136.1 U40.9(D4)
ADC5: R137.1 U40.10(D5)
ADC6: R138.1 U40.11(D6)
ADC7: R139.1 U40.12(D7)
ADC8: R141.1 U40.13(D8)
ADC9: R142.1 U40.14(D9)
ADC10: R143.1 U40.17(D10)
ADC11: R145.1 U40.18(D11)
ADC12: R146.1 U40.19(D12)
ADC13: R147.1 U40.20(D13(MSB))
ADC_ANA_SENSE_N: R144.3 R149.1
ADC_ANA_SENSE_P: R144.4 R151.1
ADC_CLK: R126.2 U40.2(CLK) ; port ADC_CLK
ADC_DIG_SENSE_N: R125.3 R129.1
ADC_DIG_SENSE_P: R125.4 R133.1
DRS4_OUT8_N: R127.1 ; port OUT.OUT8-
DRS4_OUT8_P: R361.1 ; port OUT.OUT8+
IO_B34_L7_Y16_P: R143.2 ; port ADC.ADC10
IO_B34_L7_Y17_N: R142.2 ; port ADC.ADC9
IO_B34_L10_V15_P: R146.2 ; port ADC.ADC12
IO_B34_L10_W15_N: R145.2 ; port ADC.ADC11
IO_B34_L17_Y18_P: R141.2 ; port ADC.ADC8
IO_B34_L17_Y19_N: R139.2 ; port ADC.ADC7
IO_B34_L19_R17_N: R147.2 ; port ADC.ADC13
IO_B34_L22_W18_P: R138.2 ; port ADC.ADC6
IO_B34_L22_W19_N: R137.2 ; port ADC.ADC5
IO_B35_L7_M19_P: R132.2 ; port ADC.ADC2
IO_B35_L7_M20_N: R130.2 ; port ADC.ADC1
IO_B35_L9_L19_P: R128.2 ; port ADC.ADC0
IO_B35_L21_N15_P: R136.2 ; port ADC.ADC4
IO_B35_L21_N16_N: R134.2 ; port ADC.ADC3
SCL_ADCINA226_AVDD: U43.1(A1) U43.2(A0) U43.5(SCL) ; port I2C_ADCSensor_AVDD.SCL
SCL_ADCINA226_DVDD: U41.5(SCL) ; port I2C_ADCSensor_DVDD.SCL
SCL_ADCTMP112: U42.1(SCL) ; port I2C_ADCTempSensor.SCL
SDA_ADCINA226_AVDD: U43.4(SDA) ; port I2C_ADCSensor_AVDD.SDA
SDA_ADCINA226_DVDD: U41.2(A0) U41.4(SDA) ; port I2C_ADCSensor_DVDD.SDA
SDA_ADCTMP112: U42.4(ADD0) U42.6(SDA) ; port I2C_ADCTempSensor.SDA
NetC169_2: C169.2 C172.1 C173.1 U40.26(REFT)
NetC170_2: C170.2 R126.1
NetC171_1: C171.1 R133.2 U41.10(VIN+)
NetC171_2: C171.2 R129.2 U41.9(VIN-)
NetC172_2: C172.2 C173.2 C174.2 U40.25(REFB)
NetC175_1: C175.1 C176.1 U40.24(VREF)
NetC179_1: C179.1 R151.2 U43.10(VIN+)
NetC179_2: C179.2 R149.2 U43.9(VIN-)
NetD27_1: D27.1(K) R140.2
NetD27_2: D27.2(A) Q16.3(C)
NetD28_1: D28.1(K) R154.2
NetD28_2: D28.2(A) Q17.3(C)
NetD29_1: D29.1(K) R155.2
NetD29_2: D29.2(A) Q18.3(C)
NetQ16_1: Q16.1(B) R131.1 R135.1
NetQ17_1: Q17.1(B) R148.1 R150.1
NetQ18_1: Q18.1(B) R152.1 R153.1
NetR135_2: R135.2 U41.3(ALERT)
NetR150_2: R150.2 U42.3(ALERT)
NetR153_2: R153.2 U43.3(ALERT)

Not connected (* = marked no-connect by the designer): U40 1(DNC)* 3(DNC)* 21(OTR)*

### Layout directives
differential pair: ADC_ANA_SENSE_N, ADC_ANA_SENSE_P, ADC_DIG_SENSE_N, ADC_DIG_SENSE_P

### Notes on the sheet
- DRS4 MuxOut: Place close to ADC
- (near R126) AC CLK Termination
- Zo = 22 Ω
- ADDRESS: 0X4A
- ADC Channels 13:0 Probed with Integrated Logic Analyzer
- (near U43) ADDRESS: 0X4F
- (near U41) ADDRESS: 0X42
- AD9245 3V Analog Bypass Capacitors
- (near FB16) AD9245 2V5 Digital Bypass Capacitors
- 475 Portola Plaza
- GAPS TOF
- igarcia91@g.ucla.edu
- Los Angeles, CA
- 310-825-0344
- Size:
- Date:
- Letter
- Number:
- Time:
- Sheet
- Revision:
- of
- andrew.peck@cern.ch
- spq@ucla.edu
- File:

### Library data of the parts
C123-C125 C170 = Cap_Murata_GJM1555C1H200GB01D_20pF: Multilayer Ceramic Capacitors MLCC - SMD/SMT 0402 20pF 50Volts C0G 2%; Supplier 1: Mouser; Supplier Part Number 1: 81-GJM1555C1H200GB01
C169 C171-C182 C185 C187-C189 C192 C193 C197 = Cap_Taiyo_Yuden_TMK105B7104KV-FR_100nF: CAP CER 100nF 25V X7R 0402; Supplier 1: Mouser; Supplier Part Number 1: 963-TMK105B7104KV-FR
C183 C198 = Cap_Murata_ GRM21BC71E106ME11L_10uF: CAP CER 10uF 25V X7R 0805; Supplier 1: Mouser; Supplier Part Number 1: 81-GRM21BC71E106ME1L
C184 C186 C190 C191 C194-C196 = Cap_Kemet_C0603C102J5RACAUTO_1nF: CAP CER 1nF 50V X7R 0603; Supplier 1: Mouser; Supplier Part Number 1: 80-C0603C102J5RAUTO
D27-D29 = Led_Lite-On_LTST-C193KGKT-5A_Red: Standard LEDs - SMD Red 470nm 28mcd 20mA; Supplier 1: Mouser; Supplier Part Number 1: 859-LTSTC193KRKT5A; Series: LTST-C193KRKT-5A
FB11 FB16 = FB_Wurth_Electronics_742792731_100Ohms: as FB17 on sheet ANA_FE; Supplier 1: Mouser; Supplier Part Number 1: 710-742792731
Q16-Q18 = BJT_PNP_Toshiba_TMBT3906: Bipolar Transistors - BJT Transistor for Low Freq. Amplification; Supplier 1: Mouser; Supplier Part Number 1: TMBT3906,LM
R125 R144 = SRes_KOA_PSG4NTEB1L00F_1mOhm: Current Sense Resistors - SMD 1mOhm 8W 1% 50ppm AEC-Q200 Power Shunt; Supplier 1: Mouser; Supplier Part Number 1: 660-PSG4NTEB1L00F
R126 = CMP-1011-00363-1: as R157 on sheet ANA_FE; Power: 0.063 W; Technology: SMT; Tolerance: 1 %
R127 R361 = CMP-1011-00320-1: as R166 on sheet ANA_FE; Tolerance: 1 %; Technology: SMT; Power: 0.063 W
R128-R130 R132-R134 R136-R139 R141-R143 R145-R147 R149 R151 = Res_Vishay_CRCW04020000Z0EDC_0_Ohm: 0R 0.062W 1% 0402 (1005 Metric)  SMD; Supplier 1: Mouser; Supplier Part Number 1: 71-CRCW04020000Z0EDC
R131 R148 R152 = CMP-1012-00122-1: 100K 0.1W 5% 0603 (1608 Metric)  SMD; Case-EIA: 0603; Value: 100000.00 Ohm; Case-Metric: 1608; Tolerance: 5 %; Power: 0.1 W; Technology: SMT
R135 R150 R153 = CMP-1012-00098-1: 10K 0.1W 5% 0603 (1608 Metric)  SMD; Case-EIA: 0603; Value: 10000.00 Ohm; Case-Metric: 1608; Technology: SMT; Tolerance: 5 %; Power: 0.1 W
R140 R154 R155 = CMP-1012-00070-1: 680R 0.1W 5% 0603 (1608 Metric)  SMD; Case-EIA: 0603; Value: 680.00 Ohm; Case-Metric: 1608; Tolerance: 5 %; Technology: SMT; Power: 0.1 W
TP49 TP50 = TP_TE_Connectivity_5-146280-1_1POS: Headers & Wire Housings Unshrouded 1 POS T/H; Supplier Part Number 1: 571-51462801; Supplier 1: Mouser
U40 = AD9245BCPZ-40: Analog to Digital Converters - ADC 14-Bit 40 MSPS 3V; Vendor: Analog Devices Inc; Built_By: EMA_UL_Team; C: Copyright (C) 2015 Accelerated Designs. All rights reserved; RefDes: RefDes; Type: DEV; Supplier 1: Mouser; Supplier Part Number 1: 584-AD9245BCPZ-40; Series: AD9245BCPZ-40; Part: AD9245BCPZ-40
U41 U43 = INA226AQDGSRQ1: Current & Power Monitors & Regulators Automotive, 36-V, Ultra-High Accuracy, Low-/High-Side, I2C Out Current/Power Monitor w/ Alert 10-VSSOP -40 to 125; Supplier 1: Mouser; Supplier Part Number 1: 595-INA226AQDGSRQ1
U42 = TMP112AIDRLR: Board Mount Temperature Sensors Hi-Prec Lo-Pwr Dig Temp Sensor; Supplier 1: Mouser; Supplier Part Number 1: 595-TMP112AIDRLR

## Sheet ANA_FE_CLK_SYNTH.SchDoc: My title
size A3; Organization: University of California; Address1: 475 Portola Plaza; Address2: Los Angeles, CA 90095; Revision: R01; SheetNumber: 1; SheetTotal: 1
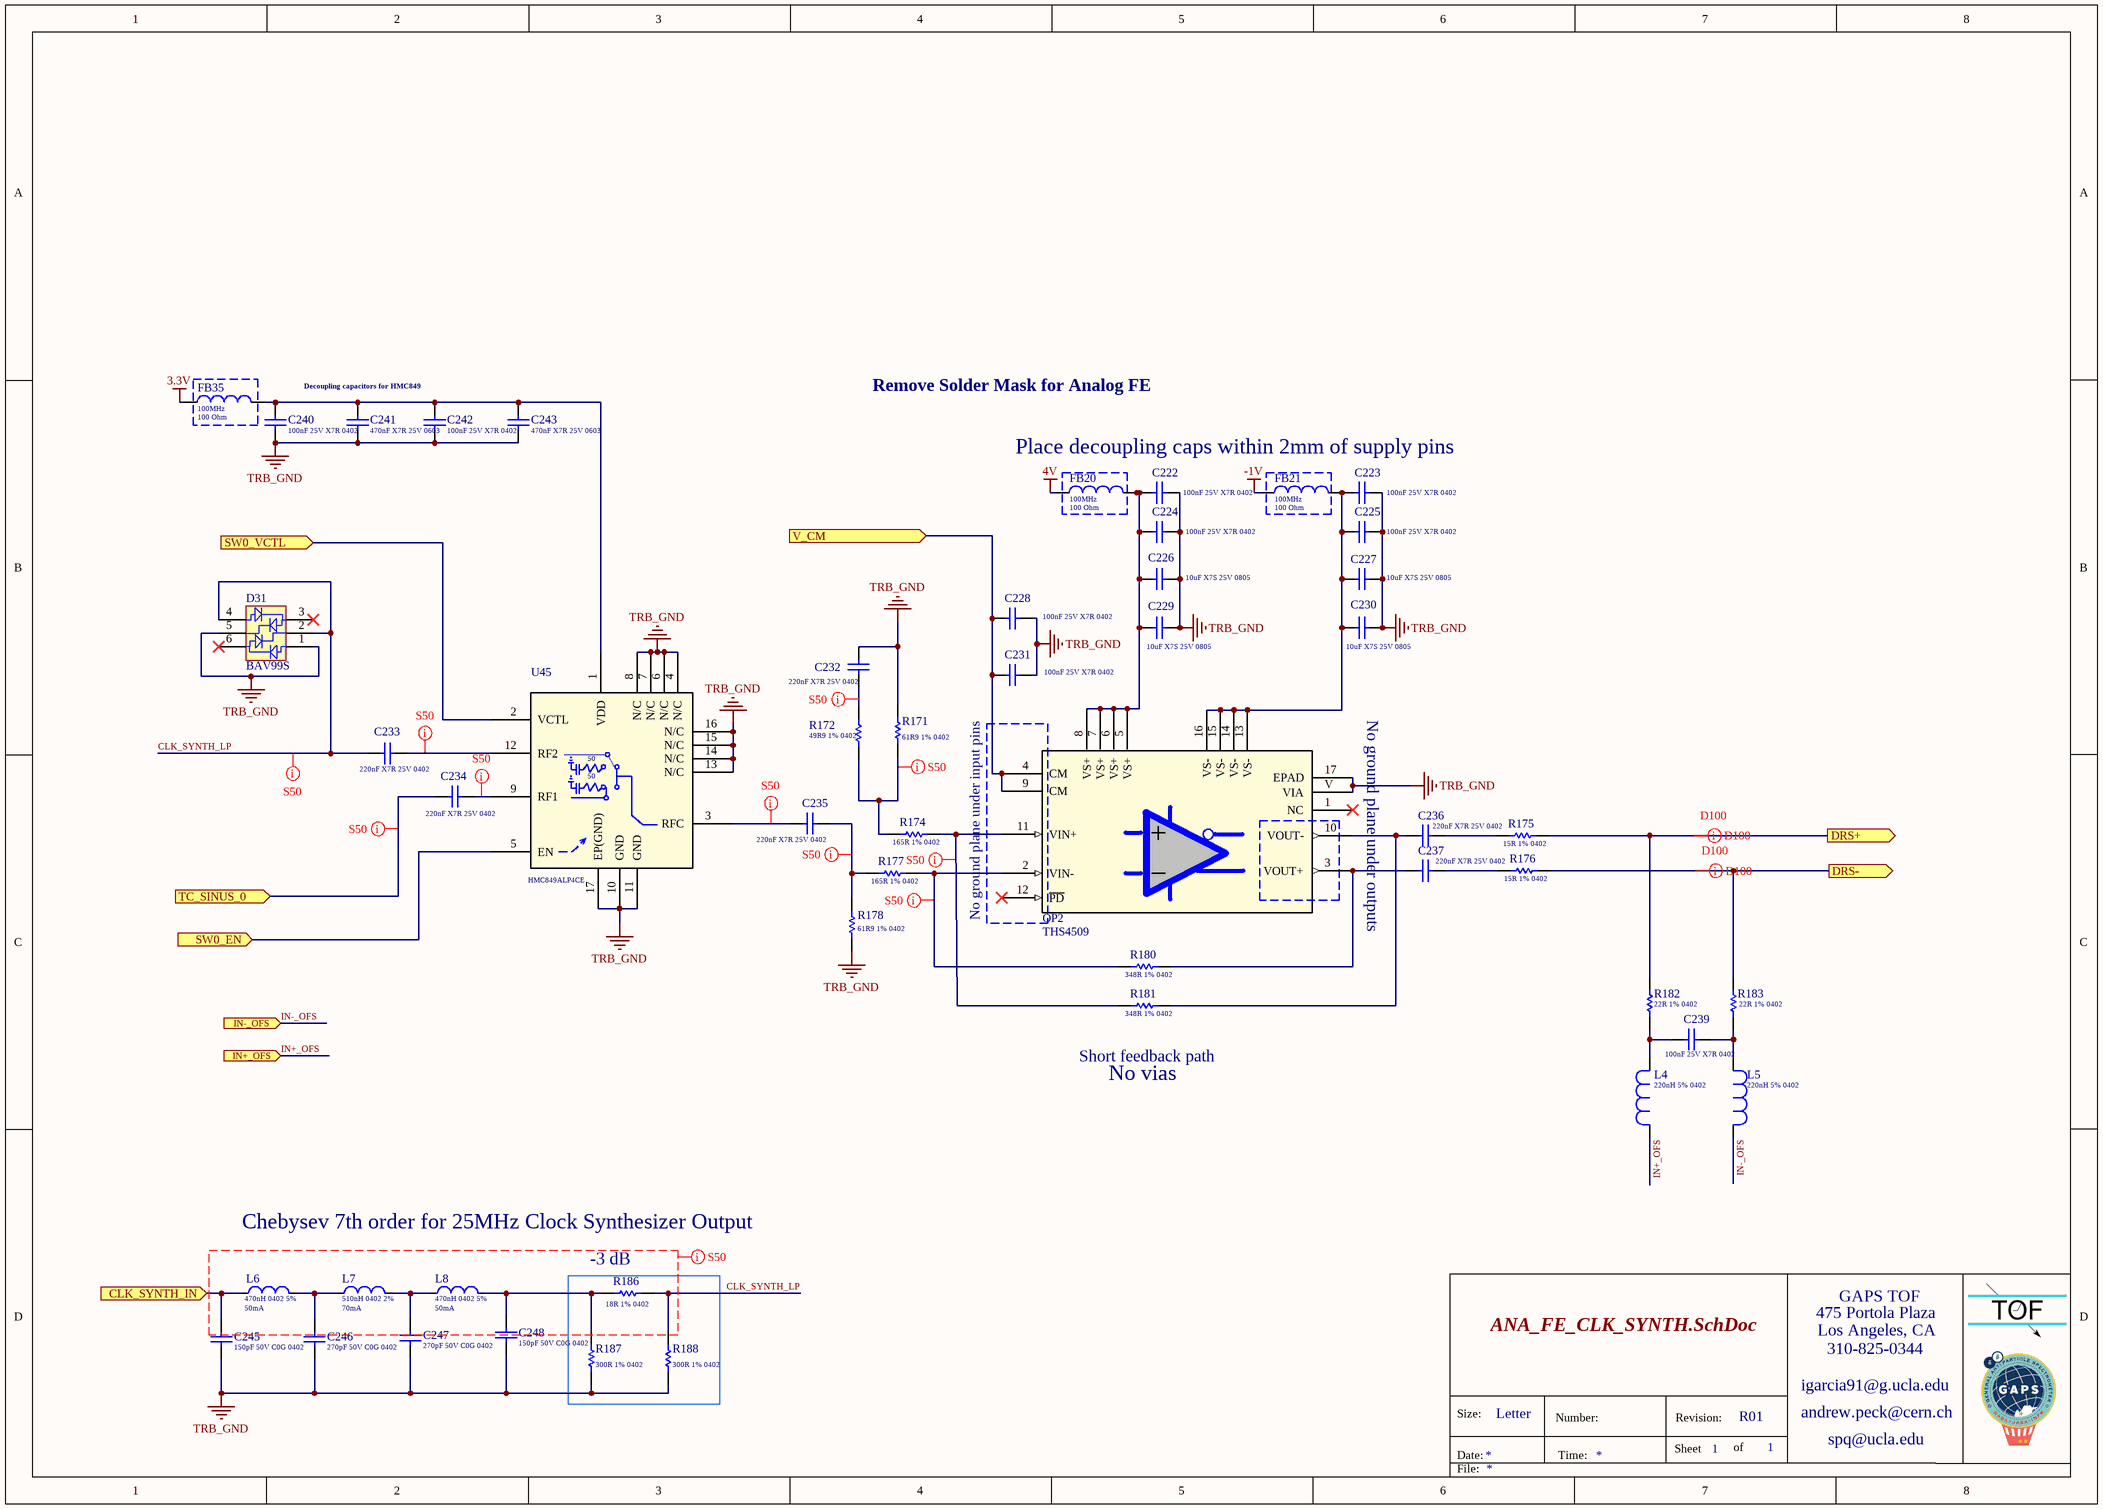
[diagram p5: ANA_FE_CLK_SYNTH.SchDoc]

### Parts
C222  Capacitance: 100nF 25V X7R 0402  [Cap_Taiyo_Yuden_TMK105B7104KV-FR_100nF]  (hidden comment: Cap_Taiyo_Yuden_TMK105B7104KV-FR_100nF)
C223  Capacitance: 100nF 25V X7R 0402  [Cap_Taiyo_Yuden_TMK105B7104KV-FR_100nF]  (hidden comment: Cap_Taiyo_Yuden_TMK105B7104KV-FR_100nF)
C224  Capacitance: 100nF 25V X7R 0402  [Cap_Taiyo_Yuden_TMK105B7104KV-FR_100nF]  (hidden comment: Cap_Taiyo_Yuden_TMK105B7104KV-FR_100nF)
C225  Capacitance: 100nF 25V X7R 0402  [Cap_Taiyo_Yuden_TMK105B7104KV-FR_100nF]  (hidden comment: Cap_Taiyo_Yuden_TMK105B7104KV-FR_100nF)
C226  Capacitance: 10uF X7S 25V 0805  [Cap_Murata_ GRM21BC71E106ME11L_10uF]  (hidden comment: Cap_Murata_ GRM21BC71E106ME11L_10uF)
C227  Capacitance: 10uF X7S 25V 0805  [Cap_Murata_ GRM21BC71E106ME11L_10uF]  (hidden comment: Cap_Murata_ GRM21BC71E106ME11L_10uF)
C228  Capacitance: 100nF 25V X7R 0402  [Cap_Taiyo_Yuden_TMK105B7104KV-FR_100nF]  (hidden comment: Cap_Taiyo_Yuden_TMK105B7104KV-FR_100nF)
C229  Capacitance: 10uF X7S 25V 0805  [Cap_Murata_ GRM21BC71E106ME11L_10uF]  (hidden comment: Cap_Murata_ GRM21BC71E106ME11L_10uF)
C230  Capacitance: 10uF X7S 25V 0805  [Cap_Murata_ GRM21BC71E106ME11L_10uF]  (hidden comment: Cap_Murata_ GRM21BC71E106ME11L_10uF)
C231  Capacitance: 100nF 25V X7R 0402  [Cap_Taiyo_Yuden_TMK105B7104KV-FR_100nF]  (hidden comment: Cap_Taiyo_Yuden_TMK105B7104KV-FR_100nF)
C232  Capacitance: 220nF X7R 25V 0402  [Cap_TDK_C1608X5R1A106M080AC_220nF]  (hidden comment: Cap_TDK_C1608X5R1A106M080AC_220nF)
C233  Capacitance: 220nF X7R 25V 0402  [Cap_TDK_C1608X5R1A106M080AC_220nF]  (hidden comment: Cap_TDK_C1608X5R1A106M080AC_220nF)
C234  Capacitance: 220nF X7R 25V 0402  [Cap_TDK_C1608X5R1A106M080AC_220nF]  (hidden comment: Cap_TDK_C1608X5R1A106M080AC_220nF)
C235  Capacitance: 220nF X7R 25V 0402  [Cap_TDK_C1608X5R1A106M080AC_220nF]  (hidden comment: Cap_TDK_C1608X5R1A106M080AC_220nF)
C236  Capacitance: 220nF X7R 25V 0402  [Cap_TDK_C1608X5R1A106M080AC_220nF]  (hidden comment: Cap_TDK_C1608X5R1A106M080AC_220nF)
C237  Capacitance: 220nF X7R 25V 0402  [Cap_TDK_C1608X5R1A106M080AC_220nF]  (hidden comment: Cap_TDK_C1608X5R1A106M080AC_220nF)
C239  Capacitance: 100nF 25V X7R 0402  [Cap_Taiyo_Yuden_TMK105B7104KV-FR_100nF]  (hidden comment: Cap_Taiyo_Yuden_TMK105B7104KV-FR_100nF)
C240  Capacitance: 100nF 25V X7R 0402  [Cap_Taiyo_Yuden_TMK105B7104KV-FR_100nF]  (hidden comment: Cap_Taiyo_Yuden_TMK105B7104KV-FR_100nF)
C241  Capacitance: 470nF X7R 25V 0603  [Cap_Wurth_Electronics_885012206075_470nF]  (hidden comment: Cap_Wurth_Electronics_885012206075_470nF)
C242  Capacitance: 100nF 25V X7R 0402  [Cap_Taiyo_Yuden_TMK105B7104KV-FR_100nF]  (hidden comment: Cap_Taiyo_Yuden_TMK105B7104KV-FR_100nF)
C243  Capacitance: 470nF X7R 25V 0603  [Cap_Wurth_Electronics_885012206075_470nF]  (hidden comment: Cap_Wurth_Electronics_885012206075_470nF)
C245  Capacitance: 150pF 50V C0G 0402  [Cap_TDK_CGA2B2C0G2A151J050BE_150pF]  (hidden comment: Cap_TDK_CGA2B2C0G2A151J050BE_150pF)
C246  Capacitance: 270pF 50V C0G 0402  [Cap_Murata_GCM1555C1H271FA16D_270pF]  (hidden comment: Cap_Murata_GCM1555C1H271FA16D_270pF)
C247  Capacitance: 270pF 50V C0G 0402  [Cap_Murata_GCM1555C1H271FA16D_270pF]  (hidden comment: Cap_Murata_GCM1555C1H271FA16D_270pF)
C248  Capacitance: 150pF 50V C0G 0402  [Cap_TDK_CGA2B2C0G2A151J050BE_150pF]  (hidden comment: Cap_TDK_CGA2B2C0G2A151J050BE_150pF)
D31  BAV99S  [INF-SOT363_V]
FB20  Measuring Frequency: 100MHz  Impedance: 100 Ohm  [FB_Wurth_Electronics_742792731_100Ohms]  (hidden comment: 742792731)
FB21  Measuring Frequency: 100MHz  Impedance: 100 Ohm  [FB_Wurth_Electronics_742792731_100Ohms]  (hidden comment: 742792731)
FB35  Measuring Frequency: 100MHz  Impedance: 100 Ohm  [FB_Wurth_Electronics_742792731_100Ohms]  (hidden comment: 742792731)
L4  Inductance: 220nH 5% 0402  [Ind_TDK_ MLG1005SR22JT000_220nH]  (hidden comment: Ind_TDK_ MLG1005SR22JT000_220nH)
L5  Inductance: 220nH 5% 0402  [Ind_TDK_ MLG1005SR22JT000_220nH]  (hidden comment: Ind_TDK_ MLG1005SR22JT000_220nH)
L6  470nH 0402 5%  Current Rating: 50mA  [TDK_MLF1005GR47JT000_0]
L7  510nH 0402 2%  Current Rating: 70mA  [TDK_MHQ1005PR51GT000_0]
L8  470nH 0402 5%  Current Rating: 50mA  [TDK_MLF1005GR47JT000_0]
OP2  THS4509  [RGT16]
R171  61R9 1% 0402  [RESC0402(1005)_L]
R172  49R9 1% 0402  [RESC0402(1005)_L]
R174  165R 1% 0402  [RESC0402(1005)_L]
R175  15R 1% 0402  [RESC0402(1005)_L]
R176  15R 1% 0402  [RESC0402(1005)_L]
R177  165R 1% 0402  [RESC0402(1005)_L]
R178  61R9 1% 0402  [RESC0402(1005)_L]
R180  348R 1% 0402  [RESC0402(1005)_L]
R181  348R 1% 0402  [RESC0402(1005)_L]
R182  22R 1% 0402  [RESC0402(1005)_L]
R183  22R 1% 0402  [RESC0402(1005)_L]
R186  18R 1% 0402  [RESC0402(1005)_L]
R187  300R 1% 0402  [RESC0402(1005)_L]
R188  300R 1% 0402  [RESC0402(1005)_L]
U45  HMC849  [CP_16_40]  (value not drawn)

### Blocks framed on the sheet
-3 dB: R186-R188

### Ports
CLK_SYNTH_IN (in), DRS+ (out), DRS- (out), IN+_OFS (in), IN-_OFS (in), SW0_EN (in), SW0_VCTL (in), TC_SINUS_0 (in), V_CM (in)

### Nets
3.3V: FB35.1
4V: FB20.1
-1V: FB21.1
TRB_GND: C222.2 C223.2 C224.2 C225.2 C226.1 C227.1 C228.2 C229.1 C230.1 C231.2 C232.1 C240.1 C241.2 C242.1 C243.2 C245.1 C246.1 C247.1 C248.1 D31.1(A1) D31.5(K5) OP2.17(EPAD) OP2.V(VIA) R171.2 R178.1 R187.1 R188.1 U45.4(N/C) U45.6(N/C) U45.7(N/C) U45.8(N/C) U45.10(GND) U45.11(GND) U45.13(N/C) U45.14(N/C) U45.15(N/C) U45.16(N/C) U45.17(EP(GND))
CLK_SYNTH_8: C245.2 L6.1 ; port CLK_SYNTH_IN
CLK_SYNTH_LP: C233.2 D31.2(K2) D31.4(A4) R186.2 R188.2
DRS4_IN8_N: R176.2 R183.2 ; port DRS-
DRS4_IN8_P: R175.2 R182.2 ; port DRS+
HMC849:EN8: U45.5(EN) ; port SW0_EN
HMC849:VCTL8: U45.2(VCTL) ; port SW0_VCTL
IN+_OFS: L4.2 ; port IN+_OFS
IN-_OFS: L5.1 ; port IN-_OFS  [project net ~{IN}~{_OFS}]
TC_8: C234.2 ; port TC_SINUS_0
V_CM: C228.1 C231.1 OP2.4(CM) OP2.9(CM) ; port V_CM
NetC222_1: C222.1 C224.1 C226.2 C229.2 FB20.2 OP2.5(VS+) OP2.6(VS+) OP2.7(VS+) OP2.8(VS+)
NetC223_1: C223.1 C225.1 C227.2 C230.2 FB21.2 OP2.13(VS-) OP2.14(VS-) OP2.15(VS-) OP2.16(VS-)
NetC232_2: C232.2 R172.2
NetC233_1: C233.1 U45.12(RF2)
NetC234_1: C234.1 U45.9(RF1)
NetC235_1: C235.1 R177.1 R178.2
NetC235_2: C235.2 U45.3(RFC)
NetC236_1: C236.1 R175.1
NetC236_2: C236.2 OP2.10(VOUT-) R181.2
NetC237_1: C237.1 R176.1
NetC237_2: C237.2 OP2.3(VOUT+) R180.2
NetC239_1: C239.1 L4.1 R182.1
NetC239_2: C239.2 L5.2 R183.1
NetC240_2: C240.2 C241.1 C242.2 C243.1 FB35.2 U45.1(VDD)
NetC246_2: C246.2 L6.2 L7.1
NetC247_2: C247.2 L7.2 L8.1
NetC248_2: C248.2 L8.2 R186.1 R187.2
NetOP2_2: OP2.2(VIN-) R177.2 R180.1
NetOP2_11: OP2.11(VIN+) R174.2 R181.1
NetR171_1: R171.1 R172.1 R174.1

Not connected (* = marked no-connect by the designer): D31 3(C3)* 6(C6)*; OP2 1(NC)* 12(~{PD})*

### Layout directives
net class S50: (no net found under the mark), CLK_SYNTH_LP, NetC232_2, NetC233_1, NetC234_1, NetC235_1, NetC235_2, NetOP2_2, NetOP2_11, NetR171_1, TC_8
differential pair; differential pair class D100: DRS4_IN8_N, DRS4_IN8_P

### Notes on the sheet
- Decoupling capacitors for HMC849
- Remove Solder Mask for Analog FE
- Place decoupling caps within 2mm of supply pins
- No ground plane under outputs
- D100
- No ground plane under input pins
- (near R181) Short feedback path
- No vias
- Chebysev 7th order for 25MHz Clock Synthesizer Output
- 475 Portola Plaza
- GAPS TOF
- igarcia91@g.ucla.edu
- Los Angeles, CA
- 310-825-0344
- Size:
- Date:
- Letter
- Number:
- Time:
- Sheet
- Revision:
- of
- andrew.peck@cern.ch
- spq@ucla.edu
- File:
- (in symbol HMC849ALP4CE) 50

### Library data of the parts
C222-C225 C228 C231 C239 C240 C242 = Cap_Taiyo_Yuden_TMK105B7104KV-FR_100nF: CAP CER 100nF 25V X7R 0402; Supplier 1: Mouser; Supplier Part Number 1: 963-TMK105B7104KV-FR
C226 C227 C229 C230 = Cap_Murata_ GRM21BC71E106ME11L_10uF: CAP CER 10uF 25V X7R 0805; Supplier 1: Mouser; Supplier Part Number 1: 81-GRM21BC71E106ME1L
C232-C237 = Cap_TDK_C1608X5R1A106M080AC_220nF: CAP CER 220nF 50V X7R 0402; Supplier 1: Mouser; Supplier Part Number 1: 810-C1005X7R1E224KBE
C241 C243 = Cap_Wurth_Electronics_885012206075_470nF: CAP CER 470nF 25V X7R 0603; Supplier 1: Mouser; Supplier Part Number 1: 710-885012206075
C245 C248 = Cap_TDK_CGA2B2C0G2A151J050BE_150pF: CAP 150pF 50V C0G ±1% 0402 (1000 Metric) Thickness 1mm SMD; Supplier 1: Mouser; Supplier Part Number 1: 810-CGA2B2C0G2A151J0
C246 C247 = Cap_Murata_GCM1555C1H271FA16D_270pF: CAP 270pF 50V C0G ±1% 0402; Supplier 1: Mouser; Supplier Part Number 1: 81-GCM1555C1H271FA6D
D31 = CMP-1176-00030-1: as D30 on sheet ANA_FE; PackageReference: SOT363; Halogen-free: TRUE; ComponentLink3URL: http://www.infineon.com/dgdl/SOT363-Package_Overview.pdf?folderId=db3a30431936bc4b01195360bd8f3cdc&fileId=db3a30431936bc4b0119536b62bf3cf5; PartNumber: BAV99S; ComponentLink3Description: Package Specification; ComponentLink2URL: http://www.infineon.com/dgdl/bav99series.pdf?folderId=db3a30431400ef6801141b5844e103ea&fileId=db3a30431400ef6801141c1b237d042f; ComponentLink1Description: Manufacturer URL; ComponentLink2Description: Datasheet; ComponentLink1URL: http://www.infineon.com/; PackageDescription: 6-Pin Small Outline Transistor Package, 1.25 x 2 mm Body; Mounting Technology: Surface Mount
FB20 FB21 FB35 = FB_Wurth_Electronics_742792731_100Ohms: as FB17 on sheet ANA_FE; Supplier 1: Mouser; Supplier Part Number 1: 710-742792731
L4 L5 = Ind_TDK_ MLG1005SR22JT000_220nH: Fixed Inductors .22 UH 5%; Supplier 1: Mouser; Supplier Part Number 1: 810-MLG1005SR22JT000
L6 L8 = Ind_TDK_MLF1005GR47JT000: IND 470nH Shielded Multilayer Inductor 50mA 420 mOhm Max 0402 (1005 Metric); Manufacturer: TDK; Value: 270.0nH; DC Resistance (DCR): 420mOhms; Part Number: MLF1005GR47JT000; ComponentLink2Description: Datasheet; Temperature: -55°C to +125°C; ComponentLink2URL: https://product.tdk.com/info/en/catalog/datasheets/inductor_commercial_decoupling_mlz1608_en.pdf; RoHS: TRUE; Temperature Range High: +125°C; Lead Free: yes; Temperature Range Low: -55°C; Tolerance: ±5%; Package: 0402 (1005); Inductance: 470nH; Supplier 1: Mouser; Supplier Part Number 1: 810-MLF1005GR47JT000
L7 = Ind_TDK_MHQ1005PR51GT000: IND 510nH Shielded Multilayer Inductor 70mA 10.2 Ohm Max 0402 (1005 Metric); Manufacturer: TDK; Value: 510.0nH; DC Resistance (DCR): 10.2Ohms; Part Number: MHQ1005PR51GT000; ComponentLink2Description: Datasheet; Temperature: -55°C to +125°C; ComponentLink2URL: https://product.tdk.com/info/en/catalog/datasheets/inductor_commercial_decoupling_mlz1608_en.pdf; RoHS: TRUE; Temperature Range High: +125°C; Lead Free: yes; Temperature Range Low: -55°C; Tolerance: ±2%; Package: 0402 (1005); Inductance: 510nH; Supplier Part Number 1: 810-MHQ1005PR51GT000; Supplier 1: Mouser
OP2 = THS4509RGTT: as OP1 on sheet ANA_FE; Manufacturer_Part_Number: THS4509RGTT; RefDes: RefDes; Type: DEV; Value: Value; Supplier 1: Mouser; Supplier Part Number 1: 595-THS4509RGTT
R171 R178 = CMP-1011-00374-1: as R156 on sheet ANA_FE; Tolerance: 1 %; Technology: SMT; Power: 0.063 W
R172 = CMP-1011-00363-1: as R157 on sheet ANA_FE; Power: 0.063 W; Technology: SMT; Tolerance: 1 %
R174 R177 = CMP-1011-00420-1: as R159 on sheet ANA_FE; Power: 0.063 W; Technology: SMT; Tolerance: 1 %
R175 R176 = CMP-1011-00302-1: as R160 on sheet ANA_FE; Tolerance: 1 %; Power: 0.063 W; Technology: SMT
R180 R181 = CMP-1011-00457-1: as R165 on sheet ANA_FE; Tolerance: 1 %; Technology: SMT; Power: 0.063 W
R182 R183 = CMP-1011-00320-1: as R166 on sheet ANA_FE; Tolerance: 1 %; Technology: SMT; Power: 0.063 W
R186 = CMP-1011-00311-1: 18R 0.063W 1% 0402 (1005 Metric)  SMD; Case-EIA: 0402; Value: 18.00 Ohm; Case-Metric: 1005; Tolerance: 1 %; Power: 0.063 W; Technology: SMT
R187 R188 = CMP-1011-00449-1: 300R 0.063W 1% 0402 (1005 Metric)  SMD; Case-EIA: 0402; Value: 300.00 Ohm; Case-Metric: 1005; Tolerance: 1 %; Technology: SMT; Power: 0.063 W
U45 = HMC849ALP4CE: as U44 on sheet ANA_FE; Manufacturer_Part_Number: HMC849ALP4CE; RefDes: RefDes; Type: DEV; Supplier 1: Mouser; Supplier Part Number 1: 584-HMC849ALP4CE; Series: HMC849ALP4CE